# Altium schematic sheet TPDS300A_USB_Type-C_Port_Protection.SchDoc: TPD6S300A USB Type-C Protection
size A4
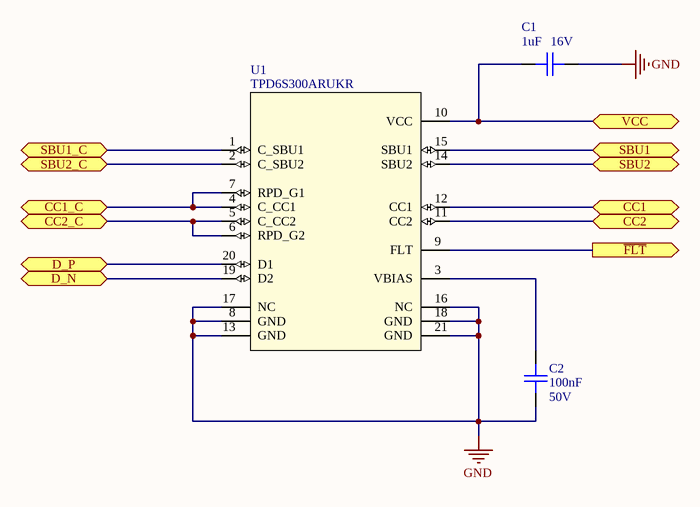
[diagram p0: TPDS300A_USB_Type-C_Port_Protection.SchDoc]

## Parts
C1  Voltage Rating: 16V  Capacitance: 1uF  [C0402]  (hidden comment: CAP CER 1UF 16V X5R 0402)
C2  Capacitance: 100nF  Voltage: 50V  [C0402]  (hidden comment: CAP CER 0.1UF 50V X7R 0402)
U1  TPD6S300ARUKR  [WQFN20_RUK_TEX]

## Ports
CC1 (bidir), CC1_C (bidir), CC2 (bidir), CC2_C (bidir), D_N (bidir), D_P (bidir), SBU1 (bidir), SBU1_C (bidir), SBU2 (bidir), SBU2_C (bidir), VCC, ~{FLT} (out)

## Nets
GND: C1.1 C2.1 U1.8(GND) U1.13(GND) U1.16(NC) U1.17(NC) U1.18(GND) U1.21(GND)
~{FLT}: U1.9(FLT) ; port ~{FLT}
CC1: U1.12(CC1) ; port CC1
CC1_C: U1.4(C_CC1) U1.7(RPD_G1) ; port CC1_C
CC2: U1.11(CC2) ; port CC2
CC2_C: U1.5(C_CC2) U1.6(RPD_G2) ; port CC2_C
D_N: U1.19(D2) ; port D_N
D_P: U1.20(D1) ; port D_P
SBU1: U1.15(SBU1) ; port SBU1
SBU1_C: U1.1(C_SBU1) ; port SBU1_C
SBU2: U1.14(SBU2) ; port SBU2
SBU2_C: U1.2(C_SBU2) ; port SBU2_C
VCC: C1.2 U1.10(VCC) ; port VCC
NetC2_2: C2.2 U1.3(VBIAS)

## Notes on the sheet
- Title
- Size:
- Date:
- A4
- Number:
- Time:
- Revision:
- Sheet
- of
- File:

## Library data of the parts
C1 = CAP CER 1UF 16V X5R 0402: 1µF ±10% 16V Ceramic Capacitor X5R 0402 (1005 Metric); Manufacturer: Yageo; Manufacturer Part Number: CC0402KRX5R7BB105; Supplier 1: Digi-Key; Stock 1: 1114963; Pricing 1: 1=0.4, 10=0.278, 100=0.167, 500=0.1253, 1000=0.1058, 2500=0.1002, 5000=0.0947 (USD); Mount: Surface Mount; Case/Package: 0402; Weight: 2.3E-05oz; Case Code (Metric): 1005; Case Code (Imperial): 0402; Min Operating Temperature: -55°C; Max Operating Temperature: 85°C; Tolerance: 10%; Packaging: Tape and Reel; Voltage Rating (DC): 16V; Dielectric: X5R; Termination: SMD/SMT; Composition: Ceramic; Length: 1mm; Height: 0.5mm; Width: 0.02inch; Thickness: 0.022inch; Depth: 0.5mm; Lead Free: Lead Free; ComponentLink1URL: http://www.yageo.com/documents/recent/UPY-GPHC_X5R_4V-to-50V_12.pdf?src-supplier=Avnet+Europe; ComponentLink1Description: http://www.yageo.com/documents/recent/UPY-GPHC_X5R_4V-to-50V_12.pdf?src-supplier=Avnet+Europe; Supplier Part Number 1: 311-1691-1-ND; Radiation Hardening: No; Halogen Free: Halogen Free
C2 = CAP CER 0.1UF 50V X7R 0402: 0.1µF ±10% 50V Ceramic Capacitor X7R 0402 (1005 Metric); Manufacturer: TDK; Manufacturer Part Number: CGA2B3X7R1H104K050BB; Supplier 1: Digi-Key; Stock 1: 2925303; Pricing 1: 1=0.17, 10=0.118, 50=0.0668, 100=0.0553, 500=0.0388, 1000=0.0321, 2500=0.0299, 5000=0.0273 (USD); Mount: Surface Mount; Case/Package: 0402; Weight: 2.3E-05oz; Case Code (Metric): 1005; Case Code (Imperial): 0402; Min Operating Temperature: -55°C; Max Operating Temperature: 125°C; Voltage Rating: 50V; Tolerance: 10%; Packaging: Tape and Reel; Package Quantity: 1; Voltage Rating (DC): 50V; Dielectric: X7R; Termination: SMD/SMT; Composition: Ceramic; Length: 1mm; Height: 0.5mm; Width: 0.02inch; Thickness: 0.022inch; Depth: 0.5mm; Ratings: AEC-Q200; REACH SVHC: No SVHC; Lead Free: Lead Free; ComponentLink1URL: http://product.tdk.com/capacitor/mlcc/en/documents/mlccspec_automotive_general_midvoltage_en.pdf?src-supplier=Future+Electronics; ComponentLink1Description: http://product.tdk.com/capacitor/mlcc/en/documents/mlccspec_automotive_general_midvoltage_en.pdf?src-supplier=Future+Electronics; ComponentLink2URL: http://www.farnell.com/datasheets/1807242.pdf?src-supplier=Element14; ComponentLink2Description: http://www.farnell.com/datasheets/1807242.pdf?src-supplier=Element14; ComponentLink3URL: http://www.mouser.com/ds/2/400/lcc_automotive_general_en-843974.pdf?src-supplier=Mouser; ComponentLink3Description: http://www.mouser.com/ds/2/400/lcc_automotive_general_en-843974.pdf?src-supplier=Mouser; ComponentLink4URL: http://www.farnell.com/datasheets/1936565.pdf?src-supplier=Element14; ComponentLink4Description: http://www.farnell.com/datasheets/1936565.pdf?src-supplier=Element14; ComponentLink5URL: http://www.farnell.com/datasheets/1735392.pdf?src-supplier=Element14; ComponentLink5Description: http://www.farnell.com/datasheets/1735392.pdf?src-supplier=Element14; Supplier Part Number 1: 445-6899-1-ND
U1 = IC TPD6S300A USB-C ESD PROTECTION: USB Type-C™ Port Protector: Short-to-VBUS Overvoltage  and IEC ESD Protection; Manufacturer: Texas Instruments; Speed: Super Speed; Operating Supply Current: 600 mA; Operating Supply Voltage: 3.3 V; Supply Voltage - Max: 3.6 V; Supply Voltage - Min: 2.7 V; Supplier 1: Mouser; Manufacturer Part Number: TPD6S300ARUKR; RoHS: RoHS Compliant; Category: USB Interface IC; Stock 1: 6078; Pricing 1: 1=1.31, 10=1.11, 100=0.852, 500=0.753, 1000=0.594, 3000=0.555, 6000=0.527, 9000=0.507 (USD); Data Rate: -; Package / Case: WQFN-20; Packaging: Cut Tape; Product: USB Protectors; Brand: Texas Instruments; Mounting Style: SMD/SMT; Maximum Operating Temperature: + 85 C; Minimum Operating Temperature: - 40 C; Moisture Sensitive: Yes; Product Type: USB Interface IC; Standard: USB-C 2.0; Standard Pack Qty: 3000; Subcategory: Interface ICs; RoHS - Mouser: Y; Minimum Order Quantity: 1; Reeling: True; Supplier 2: Digi-Key; Supplier Part Number 1: 595-TPD6S300ARUKR; Supplier Part Number 2: 296-51856-1-ND; Series: TPD6S300A; Interface Type: USB; ESD Protection: ESD Protection; Mount: Surface Mount